# EAGLE design PCB-E21-TVS (EAGLE 7.5.0)

## Sheet 1 of 2
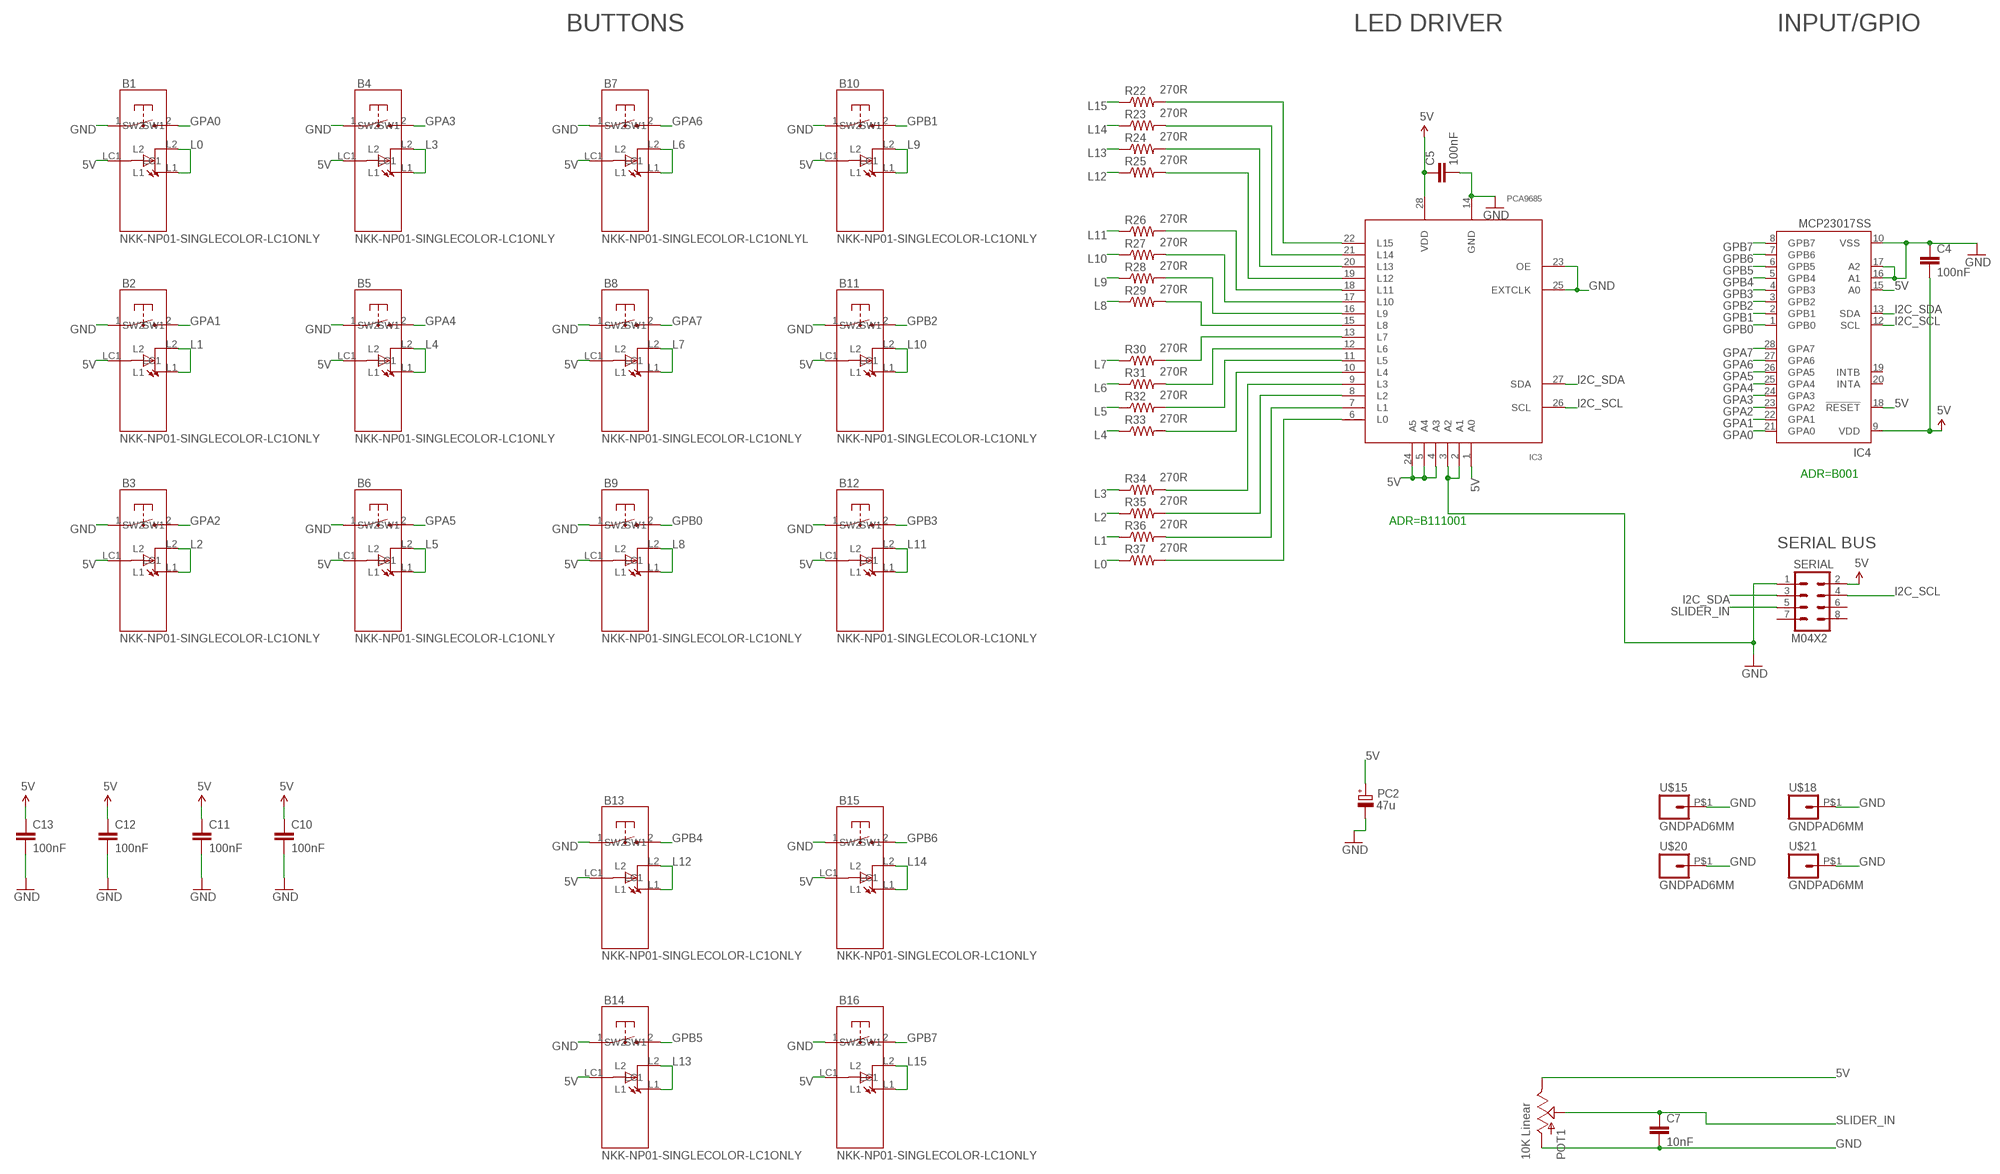
[diagram p0: schematic, sheet 1]

### Parts
B1  NKK-NP01-SINGLECOLOR-LC1ONLY  [NKK-NP01_LESSHOLES2]
B2  NKK-NP01-SINGLECOLOR-LC1ONLY  [NKK-NP01_LESSHOLES2]
B3  NKK-NP01-SINGLECOLOR-LC1ONLY  [NKK-NP01_LESSHOLES2]
B4  NKK-NP01-SINGLECOLOR-LC1ONLY  [NKK-NP01_LESSHOLES2]
B5  NKK-NP01-SINGLECOLOR-LC1ONLY  [NKK-NP01_LESSHOLES2]
B6  NKK-NP01-SINGLECOLOR-LC1ONLY  [NKK-NP01_LESSHOLES2]
B7  NKK-NP01-SINGLECOLOR-LC1ONLYL  [NKK-NP01_LESSHOLES3]
B8  NKK-NP01-SINGLECOLOR-LC1ONLY  [NKK-NP01_LESSHOLES2]
B9  NKK-NP01-SINGLECOLOR-LC1ONLY  [NKK-NP01_LESSHOLES2]
B10  NKK-NP01-SINGLECOLOR-LC1ONLY  [NKK-NP01_LESSHOLES2]
B11  NKK-NP01-SINGLECOLOR-LC1ONLY  [NKK-NP01_LESSHOLES2]
B12  NKK-NP01-SINGLECOLOR-LC1ONLY  [NKK-NP01_LESSHOLES2]
B13  NKK-NP01-SINGLECOLOR-LC1ONLY  [NKK-NP01_LESSHOLES2]
B14  NKK-NP01-SINGLECOLOR-LC1ONLY  [NKK-NP01_LESSHOLES2]
B15  NKK-NP01-SINGLECOLOR-LC1ONLY  [NKK-NP01_LESSHOLES2]
B16  NKK-NP01-SINGLECOLOR-LC1ONLY  [NKK-NP01_LESSHOLES2]
C4  100nF  CAP0603-CAP  [0603-CAP]
C5  100nF  CAP0603-CAP  [0603-CAP]
C7  10nF  CAP0603-CAP  [0603-CAP]
C10  100nF  CAP0603-CAP  [0603-CAP]
C11  100nF  CAP0603-CAP  [0603-CAP]
C12  100nF  CAP0603-CAP  [0603-CAP]
C13  100nF  CAP0603-CAP  [0603-CAP]
IC3  PCA9685  [TSSOP28]
IC4  MCP23017SS  [SSOP28]
PC2  47u  CPOL-EUD  [PANASONIC_D]
POT1  10K Linear  SLIDERC220  [SLIDER20-CAR2]
R22  270R  RESISTOR0603-RES  [0603-RES]
R23  270R  RESISTOR0603-RES  [0603-RES]
R24  270R  RESISTOR0603-RES  [0603-RES]
R25  270R  RESISTOR0603-RES  [0603-RES]
R26  270R  RESISTOR0603-RES  [0603-RES]
R27  270R  RESISTOR0603-RES  [0603-RES]
R28  270R  RESISTOR0603-RES  [0603-RES]
R29  270R  RESISTOR0603-RES  [0603-RES]
R30  270R  RESISTOR0603-RES  [0603-RES]
R31  270R  RESISTOR0603-RES  [0603-RES]
R32  270R  RESISTOR0603-RES  [0603-RES]
R33  270R  RESISTOR0603-RES  [0603-RES]
R34  270R  RESISTOR0603-RES  [0603-RES]
R35  270R  RESISTOR0603-RES  [0603-RES]
R36  270R  RESISTOR0603-RES  [0603-RES]
R37  270R  RESISTOR0603-RES  [0603-RES]
SERIAL  M04X2  [2X4]
U$15  GNDPAD6MM  [3.2MMPAD6MM]
U$18  GNDPAD6MM  [3.2MMPAD6MM]
U$20  GNDPAD6MM  [3.2MMPAD6MM]
U$21  GNDPAD6MM  [3.2MMPAD6MM]

### Nets
5V [Power]: B1.LC1 B2.LC1 B3.LC1 B4.LC1 B5.LC1 B6.LC1 B7.LC1 B8.LC1 B9.LC1 B10.LC1 B11.LC1 B12.LC1 B13.LC1 B14.LC1 B15.LC1 B16.LC1 C4.2 C5.1 C10.1 C11.1 C12.1 C13.1 IC3.1(A0) IC3.4(A3) IC3.5(A4) IC3.24(A5) IC3.28(VDD) IC4.9(VDD) IC4.15(A0) IC4.18(!RESET) PC2.+ POT1.1(E) SERIAL.2
GND [Power]: B1.1(SW1) B2.1(SW1) B3.1(SW1) B4.1(SW1) B5.1(SW1) B6.1(SW1) B7.1(SW1) B8.1(SW1) B9.1(SW1) B10.1(SW1) B11.1(SW1) B12.1(SW1) B13.1(SW1) B14.1(SW1) B15.1(SW1) B16.1(SW1) C4.1 C5.2 C7.2 C10.2 C11.2 C12.2 C13.2 IC3.2(A1) IC3.3(A2) IC3.14(GND) IC3.23(OE) IC3.25(EXTCLK) IC4.10(VSS) IC4.16(A1) IC4.17(A2) PC2.- POT1.3(A) SERIAL.1 U$15.P$1 U$18.P$1 U$20.P$1 U$21.P$1
GPA0: B1.2(SW2) IC4.21(GPA0)
GPA1: B2.2(SW2) IC4.22(GPA1)
GPA2: B3.2(SW2) IC4.23(GPA2)
GPA3: B4.2(SW2) IC4.24(GPA3)
GPA4: B5.2(SW2) IC4.25(GPA4)
GPA5: B6.2(SW2) IC4.26(GPA5)
GPA6: B7.2(SW2) IC4.27(GPA6)
GPA7: B8.2(SW2) IC4.28(GPA7)
GPB0 [Power]: B9.2(SW2) IC4.1(GPB0)
GPB1: B10.2(SW2) IC4.2(GPB1)
GPB2: B11.2(SW2) IC4.3(GPB2)
GPB3: B12.2(SW2) IC4.4(GPB3)
GPB4: B13.2(SW2) IC4.5(GPB4)
GPB5: B14.2(SW2) IC4.6(GPB5)
GPB6: B15.2(SW2) IC4.7(GPB6)
GPB7: B16.2(SW2) IC4.8(GPB7)
I2C_SCL: IC3.26(SCL) IC4.12(SCL) SERIAL.4
I2C_SDA: IC3.27(SDA) IC4.13(SDA) SERIAL.3
L0: B1.L1 B1.L2 R37.1
L1: B2.L1 B2.L2 R36.1
L2: B3.L1 B3.L2 R35.1
L3: B4.L1 B4.L2 R34.1
L4: B5.L1 B5.L2 R33.1
L5: B6.L1 B6.L2 R32.1
L6: B7.L1 B7.L2 R31.1
L7: B8.L1 B8.L2 R30.1
L8: B9.L1 B9.L2 R29.1
L9: B10.L1 B10.L2 R28.1
L10: B11.L1 B11.L2 R27.1
L11: B12.L1 B12.L2 R26.1
L12: B13.L1 B13.L2 R25.1
L13: B14.L1 B14.L2 R24.1
L14: B15.L1 B15.L2 R23.1
L15: B16.L1 B16.L2 R22.1
N$2: IC3.13(L7) R30.2
N$19: IC3.12(L6) R31.2
N$23: IC3.11(L5) R32.2
N$31: IC3.10(L4) R33.2
N$58: IC3.9(L3) R34.2
N$59: IC3.8(L2) R35.2
N$67: IC3.7(L1) R36.2
N$74: IC3.6(L0) R37.2
N$75: IC3.15(L8) R29.2
N$76: IC3.16(L9) R28.2
N$77: IC3.17(L10) R27.2
N$78: IC3.18(L11) R26.2
N$79: IC3.19(L12) R25.2
N$80: IC3.20(L13) R24.2
N$81: IC3.21(L14) R23.2
N$82: IC3.22(L15) R22.2
SLIDER_IN: C7.1 POT1.2A(S) SERIAL.5
Unconnected: IC4.19(INTB) IC4.20(INTA) SERIAL.6 SERIAL.7 SERIAL.8

### Notes on the sheet
- BUTTONS | LED DRIVER | INPUT/GPIO
- ADR=B001
- ADR=B111001
- SERIAL BUS

## Sheet 2 of 2

## Library data of the parts
B1-B16 = SKAARHOJ:NKK-NP01-SINGLECOLOR-LC1ONLY
C4 C5 C7 C10-C13 = SparkFun:CAP: Capacitor Standard 0603 ceramic capacitor, and 0.1" leaded capacitor.
IC3 = wsmith:PCA9685
IC4 = microchip:MCP23017: http://ww1.microchip.com/downloads/en/DeviceDoc/21952a.pdf Source: http://ww1.microchip.com/downloads/en/DeviceDoc/21952a.pdf; MF: MICROCHIP; MPN: MCP23017-E/SS; OC_FARNELL: 1467674; OC_NEWARK: 31K2960
PC2 = rcl:CPOL-EU: POLARIZED CAPACITOR, European symbol
POT1 = SKAARHOJ:SLIDER
R22-R37 = SparkFun:RESISTOR: Resistor Basic schematic elements and footprints for 0603, 1206, and PTH resistors.
SERIAL = SparkFun:M04X2
U$15 U$18 U$20 U$21 = SKAARHOJ:GNDPAD

## Net classes
0 default: width 0.203 mm, drill 0.305 mm, clearance 0.203 mm
1 Power: width 0.406 mm, drill 0.457 mm, clearance 0.203 mm
2 RELAY LINES: width 0.305 mm, drill 0.305 mm, clearance 0.203 mm
3 INput lines: width 0.203 mm, drill 0.305 mm, clearance 0.203 mm

## Board
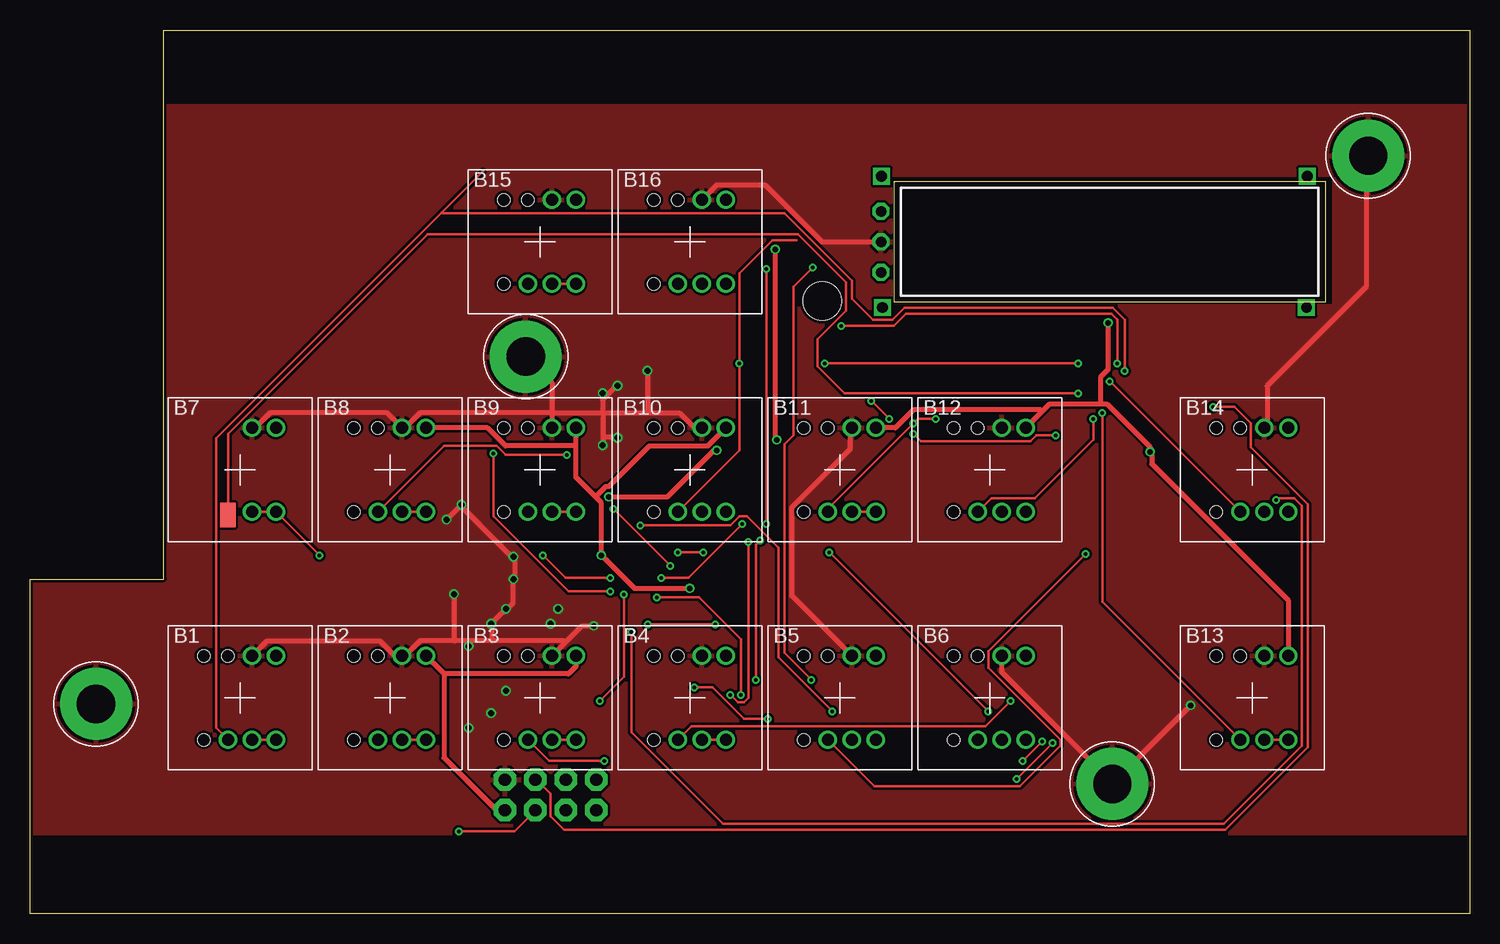
[diagram p1: board, top side]
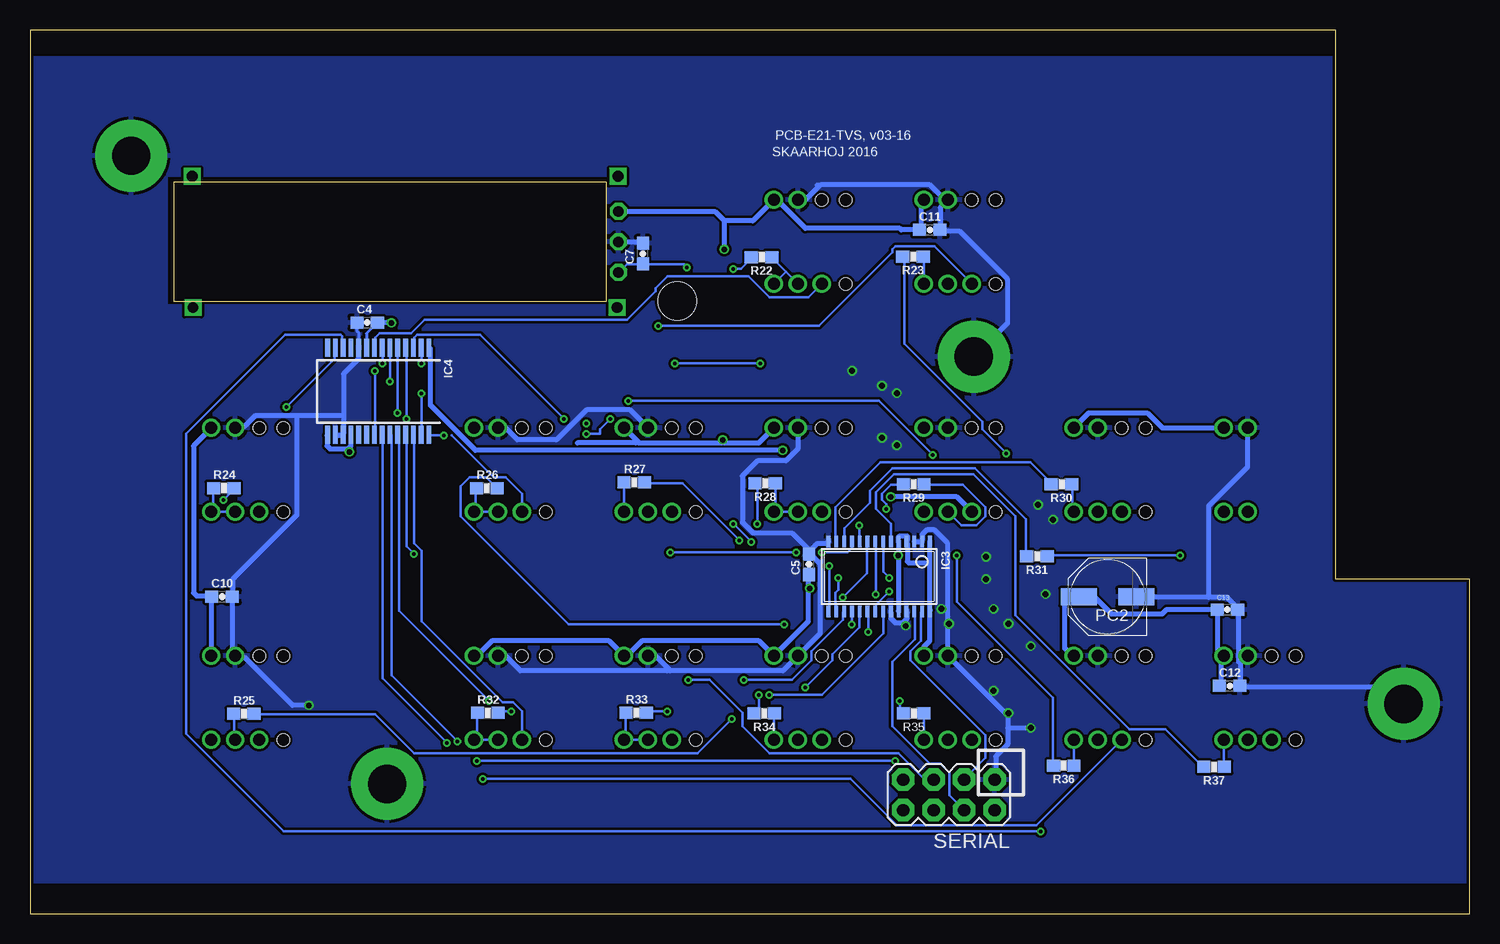
[diagram p2: board, bottom side, seen from below]

Size 120 x 73.66 mm. Coordinates in mm from the lower left corner, seen from the top.
Outline: 0,0 0,27.9 11.16,27.9 11.16,73.66 120,73.66 120,0 0,0
Copper layers (1*16): Top 0.035mm / dielectric 1.5mm / Bottom 0.035mm
Design rules "Fusion_eagle_rule_v1.1": minimum track width 6mil, minimum drill 12mil, track to track 6mil, track to pad 6mil, pad to pad 6mil, via to via 6mil, smd to smd 0mil, copper to edge 10mil, drill to drill 10mil, minimum pad ring 10mil, minimum via ring 6mil, stop-mask expansion 2mil, vias tented up to drill 100mil, thermal gap 10mil
Holes 3.2 mm at 66.04,51.07
tRestrict: area 0,0 to 120,6.5; area 0,67.5 to 120,74; area 71.9,50.8 to 108.5,61.4
bRestrict: area 0,71.5 to 120,74; area 0,0 to 120,2.5; area 71.9,50.8 to 108.5,61.4
Milling: area 72,51 to 108,61

### Footprints (pad centres in the part's own frame; a part is rotated, then mirrored left to right if it is on the bottom)
NKK-NP01_LESSHOLES2 = drill 1: 1 1,3.5; 2 -1,-3.5; L1 3,-3.5; L2 1,-3.5; LC1 3,3.5 | hole 1: -3,3.5; -3,-3.5; -1,3.5
NKK-NP01_LESSHOLES3 = drill 1: 1 1,3.5; L1 3,-3.5; L2 1,-3.5; LC1 3,3.5 | smd 1.27 x 2.032: 2 -1,-3.754
0603-CAP = smd 1.1 x 1: 1 -0.85,0; 2 0.85,0
TSSOP28 = smd 0.305 x 0.991: 1 -4.225,-2.918; 2 -3.575,-2.918; 3 -2.925,-2.918; 4 -2.275,-2.918; 5 -1.625,-2.918; 6 -0.975,-2.918; 7 -0.325,-2.918; 8 0.325,-2.918; 9 0.975,-2.918; 10 1.625,-2.918; 11 2.275,-2.918; 12 2.925,-2.918; 13 3.575,-2.918; 14 4.225,-2.918; 15 4.225,2.918; 16 3.575,2.918; 17 2.925,2.918; 18 2.275,2.918; 19 1.625,2.918; 20 0.975,2.918; 21 0.325,2.918; 22 -0.325,2.918; 23 -0.975,2.918; 24 -1.625,2.918; 25 -2.275,2.918; 26 -2.925,2.918; 27 -3.575,2.918; 28 -4.225,2.918
SSOP28 = smd 0.4 x 1.5: 1 -4.225,-3.625; 2 -3.575,-3.625; 3 -2.925,-3.625; 4 -2.275,-3.625; 5 -1.625,-3.625; 6 -0.975,-3.625; 7 -0.325,-3.625; 8 0.325,-3.625; 9 0.975,-3.625; 10 1.625,-3.625; 11 2.275,-3.625; 12 2.925,-3.625; 13 3.575,-3.625; 14 4.225,-3.625; 15 4.225,3.625; 16 3.575,3.625; 17 2.925,3.625; 18 2.275,3.625; 19 1.625,3.625; 20 0.975,3.625; 21 0.325,3.625; 22 -0.325,3.625; 23 -0.975,3.625; 24 -1.625,3.625; 25 -2.275,3.625; 26 -2.925,3.625; 27 -3.575,3.625; 28 -4.225,3.625
PANASONIC_D = smd 3 x 1.4: + 2.4,0; - -2.4,0
SLIDER20-CAR2 = drill 0.9 octagon: 1 -19.05,2.54; 2A -19.05,-2.54; 3 -19.05,0 | drill 0.9 square: P$1 -19.012,5.461; P$2 16.472,5.461; P$3 16.408,-5.461; P$4 -18.948,-5.461
0603-RES = smd 1.1 x 1: 1 -0.85,0; 2 0.85,0
2X4 = drill 1.016 pad 1.88 octagon: 1 -3.81,-1.27; 2 -3.81,1.27; 3 -1.27,-1.27; 4 -1.27,1.27; 5 1.27,-1.27; 6 1.27,1.27; 7 3.81,-1.27; 8 3.81,1.27
3.2MMPAD6MM = drill 3.2 pad 6: P$1 0,0

### Placement (x,y rotation side)
B1  17.5,18 0 top
B2  30,18 0 top
B3  42.5,18 0 top
B4  55,18 0 top
B5  67.5,18 0 top
B6  80,18 0 top
B7  17.5,37 0 top
B8  30,37 0 top
B9  42.5,37 0 top
B10  55,37 0 top
B11  67.5,37 0 top
B12  80,37 0 top
B13  101.88,18 0 top
B14  101.88,37 0 top
B15  42.5,56 0 top
B16  55,56 0 top
C4  91.89,49.28 0 bottom
C5  55.07,29.13 90 bottom
C7  68.91,55.03 90 bottom
C10  104,26.44 0 bottom
C11  45,57 0 bottom
C12  20,19 0 bottom
C13  20.18,25.36 0 bottom
IC3  49.21,28.12 180 bottom
IC4  90.97,43.54 180 bottom
PC2  30.18,26.42 180 bottom
POT1  90,56 0 top
R22  59.02,54.74 180 bottom
R23  46.39,54.77 180 bottom
R24  103.85,35.49 0 bottom
R25  102.18,16.67 0 bottom
R26  81.91,35.49 0 bottom
R27  69.62,35.97 0 bottom
R28  58.72,35.88 180 bottom
R29  46.33,35.81 180 bottom
R30  34.02,35.8 180 bottom
R31  36.06,29.8 180 bottom
R32  81.84,16.74 0 bottom
R33  69.47,16.76 0 bottom
R34  58.79,16.7 180 bottom
R35  46.34,16.7 180 bottom
R36  33.82,12.36 180 bottom
R37  21.29,12.24 180 bottom
SERIAL  43.4,9.92 180 bottom
U$15  90.23,10.84 0 top
U$18  111.56,63.18 0 top
U$20  5.5,17.5 0 top
U$21  41.32,46.44 0 top

### Tracks (layer width: path | path; a pad name or v marks a point on that pad's centre or on a via)
5V  (via drill 0.46)
  Top 0.406: 34.5,20 34.5,13 38.75,8.75 39.5,8.75 SERIAL.2 | B2.LC1 34.5,20 | 45.5,39 45.5,36.38 47.12,34.75 | 45.5,39 B9.LC1 | 47.12,34.75 47.62,34.25 v47.62,29.88 50.38,27.12 v55,27.12 | B8.LC1 38.12,40.5 39.62,39 45.5,39 | B10.LC1 56.5,39 51.62,39 48.25,35.62 48,35.62 47.12,34.75 | v62.12,55.38 62.12,39.62 v62.25,39.5 | 34.5,20 44.88,20 45.5,20.62 B3.LC1 | 89.25,42.5 85,42.5 84.38,41.88 | 89.25,42.5 89.75,42.5 93.38,38.88 v93.38,38.5 93.5,38.38 93.5,37.5 104.88,26.12 B13.LC1 | B12.LC1 84.38,41.88 | v89.88,49.25 89.88,45.38 89.25,44.75 89.25,42.5 | B11.LC1 72.12,40.5 73.62,42 84.25,42 84.38,41.88
  Bottom 0.254: C4.2 91.94,48.37 IC4.9
  Bottom 0.406: B13.LC1 104.88,26.38 C10.1 105,26.5 106.12,26.5 106.38,26.75 106.38,39 105,40.38 B14.LC1 104.62,40.5 | C12.1 20.75,19 20.75,21.25 B1.LC1 21,22 21,25.25 C13.1 21.12,25.38 25.25,25.38 25.62,25 29.88,25 31.25,26.38 32.5,26.38 PC2.+ 32.62,26.38 33.62,26.38 33.75,26.25 33.75,22.12 33.12,21.5 B2.LC1 | B15.LC1 45.75,59.25 45.75,57 C11.1 47.38,57 47.5,57.12 55.38,57.12 57.75,59.5 B16.LC1 59.75,57.75 62.12,57.75 | 55.12,27.12 55.12,24.38 B4.LC1 59.25,22.75 69,22.75 70.25,21.5 B5.LC1 71.75,22.75 81.5,22.75 82.75,21.5 B6.LC1 | 55.12,27.12 55.12,28.25 C5.1 | B10.LC1 59.25,39.25 62.25,39.25 | 62.25,39.25 69.25,39.25 69.38,39.38 | B11.LC1 69.38,39.38 | 74.38,39.25 69.5,39.25 69.38,39.38 | B7.LC1 25.62,40.5 26.88,41.75 31.75,41.75 B8.LC1 | B3.LC1 45.5,22.25 45,22.75 45,25.12 IC3.28 45,25.38 45,29.25 | 45,29.25 45,31 IC3.1 | IC3.24 47.62,25.25 v47.62,29.88 47.62,31 IC3.5 47.62,31.12 47.62,31.38 47.5,31.5 46.88,31.5 46.88,31.12 IC3.4 46.88,30.88 46.88,29.38 46.75,29.25 45,29.25 | v55,27.12 55.12,27.12 | v62.12,55.38 62.12,57.75 | v62.25,39.5 62.25,39.25 | 62.12,57.75 62.88,58.5 70.88,58.5 POT1.1 | 93.5,38.75 93.25,39 93.25,39.88 IC4.18 | 93.5,38.75 95,38.75 95.25,39 95.25,39.88 IC4.15 | v93.38,38.5 93.38,38.62 93.5,38.75 | v89.88,49.25 91,49.25 C4.2
GND  (via drill 0.46, 0.5)
  Top 0.406: 111.5,63.12 U$18.P$1 111.38,63 111.38,52.25 103.12,44 103.12,40.62 B14.1 103,40.5 | B6.1 81,20.12 90.25,10.88 U$15.P$1 90.38,11 v96.75,17.38 | 68.75,40.5 B11.1 68.38,40.38 68.38,38.75 63.5,33.88 63.5,26.5 B5.1 | B7.1 18.75,40.5 20,41.75 29.75,41.75 B8.1 31.12,40.62 31.38,40.62 32.5,41.75 43.5,41.75 | 43.5,41.75 43.5,44.25 41.38,46.38 U$21.P$1 | 43.5,41.75 B9.1 | B10.1 55.38,40.5 54.12,41.75 51.5,41.75 | 43.5,41.75 47.75,41.75 | 47.75,41.75 51.5,41.75 | v47,24 46,24 44.62,22.62 | B3.1 44.62,22.62 | 38.5,22.75 44.5,22.75 44.62,22.62 | 38.5,22.75 36.62,22.75 | 36.62,22.75 35.38,22.75 | 35.38,22.75 32.5,22.75 31.25,21.5 B2.1 30.88,21.62 30.25,21.62 29.12,22.75 19.75,22.75 B1.1 | v34.72,32.86 34.75,32.88 35.88,34 v35.96,34.1 36,33.88 40.12,29.75 v40.3,29.76 40.38,29.75 40.38,28 v40.3,27.9 40.25,27.75 40.25,25.88 39.88,25.5 v39.68,25.42 39.62,25.38 38.5,24.25 v38.44,24.18 38.5,24.12 38.5,22.75 | 35.38,22.75 35.38,26.62 v35.34,26.66 | 36.62,22.75 36.62,22.38 v36.58,22.32 | 47.75,41.75 47.75,39.75 | 47.75,39.75 47.75,39.12 v47.74,39.06 | 47.75,41.75 47.75,43.38 v47.74,43.4 47.88,43 48.88,44 v48.98,44.02 | 47.75,39.75 48.88,39.75 v48.98,39.68 | 51.5,41.75 51.5,45.25 v51.46,45.26 | POT1.3 66,56 61.25,60.75 57.25,60.75 B16.1
  Bottom 0.254: IC4.10 92.58,47.18 92.58,48.41 92.74,48.57 C4.1
  Bottom 0.406: B14.1 102.75,40.62 102.12,40.62 101.25,41.5 97.75,41.5 | IC3.14 53.5,31 53.62,30.88 54.38,30.88 55,30.25 55,30 C5.2 | C5.2 54.88,29.88 54.12,29.12 54.12,23.38 B4.1 57.25,20.25 66.62,20.25 66.75,20.38 | B5.1 67.88,21.5 66.75,20.38 | B6.1 80.38,21.5 79.12,20.25 66.88,20.25 66.75,20.38 | B16.1 55.38,59.5 54.25,60.62 | 54.25,60.62 54.12,60.75 45,60.75 43.75,59.5 B15.1 44.12,58.88 44.12,57 C11.2 44,56.88 42.5,56.88 38.5,52.88 38.5,49.25 41.25,46.5 U$21.P$1 | 47.25,24.25 46.88,24.62 46.88,25.12 IC3.25 | 47.25,24.25 47.88,24.25 48.25,24.62 48.25,25.12 IC3.23 | IC3.3 46.25,31 45.75,31 IC3.2 45.62,31.25 45.62,31.62 45.25,32 44.62,32 43.5,30.88 43.5,25.5 | 43.5,24.25 B3.1 40.12,18.12 | 43.5,24.25 43.5,25.5 | v47,24 47.25,24.25 | 38.5,15.5 38.5,16.5 38.62,16.62 | 38.5,15.5 38.5,14.12 39.5,13.12 39.5,11.25 SERIAL.1 | 40.12,18.12 38.62,16.62 | 19.12,20.88 19.12,19 C12.2 19,18.88 6.88,18.88 U$20.P$1 | B1.1 19.12,20.88 | 19.12,20.88 19.25,21 19.25,25.25 C13.2 19.38,25.5 20.25,26.38 21.75,26.38 | 21.75,26.38 27.75,26.38 PC2.- | B7.1 18.5,37.25 21.75,34 21.75,26.38 | B10.1 56,38.75 57,37.75 59.38,37.75 60.62,36.5 60.62,32.62 59.75,31.75 56.5,31.75 55.12,30.38 C5.2 | 54.38,60.75 54.25,60.62 | IC4.16 94.5,39.88 94,39.88 IC4.17 93.88,40.12 93.88,41.5 | 93.88,41.5 93.88,45 92.62,46.25 92.62,47.12 IC4.10 | 93.88,41.5 97.75,41.5 | 97.75,41.5 97.75,33.25 103.12,27.88 103.12,26.62 C10.2 103.12,26.38 103.12,21.62 103,21.5 B13.1 102.75,21.38 102.12,21.38 98.12,17.38 v96.75,17.38 | POT1.3 69,56 C7.2 | 38.5,15.5 v36.58,15.5 | v38.44,16.74 38.5,16.75 38.62,16.62 | 40.12,18.12 39.75,18.5 v39.68,18.6
  Bottom 0.406: v43.4,24.18 43.38,24.25 43.5,24.25 | 43.5,25.5 44,25.5 v44.02,25.42 | B12.1 80.38,40.5 79.38,39.5 76.12,39.5 73.62,42 70,42 B11.1
  pour Top: 0,0 120.28,0 120.28,73.78 0,73.78
  pour Bottom: 0,0 120.28,0 120.28,73.78 0,73.78
GPA0  (via drill 0.3)
  Top 0.203: 34.31,58.44 15.5,39.62 15.5,15.5 B1.2 | 34.31,58.44 37.75,61.88 | v91.25,45.25 91.25,49.5 90.25,50.5 72.88,50.5 71.88,49.5 70.25,49.5 68.5,51.25 68.5,52.75 62.88,58.38 34.38,58.38 34.31,58.44
  Bottom 0.203: v91.25,45.25 91.25,40 IC4.21
GPA1  (via drill 0.3)
  Top 0.203: v82.25,11.25 v85.25,14.25
  Bottom 0.203: v85.25,14.25 90.62,19.62 90.62,39.88 IC4.22 | v82.25,11.25 51.62,11.25 47.75,7.38 36.12,7.38 B2.2
GPA2  (via drill 0.3)
  Top 0.203: v82.75,12.75 v84.38,14.38 | v47.88,12.75 43.25,12.75 B3.2
  Bottom 0.203: v84.38,14.38 89.88,19.88 89.88,39.88 IC4.23 | v47.88,12.75 v82.75,12.75
GPA3  (via drill 0.3)
  Top 0.203: v81.75,17.75 79.62,15.62 55.12,15.62 B4.2
  Bottom 0.203: v81.75,17.75 89.25,25.25 89.25,39.88 IC4.24
GPA4  (via drill 0.3)
  Top 0.203: v88,30 79.88,21.88 79.88,20.5 85.88,14.5 85.88,14 82.5,10.62 70.38,10.62 B5.2
  Bottom 0.203: v88,30 88.62,30.62 88.62,39.88 IC4.25
GPA5
  Bottom 0.203: B6.2 79,16.88 79.75,17.62 80.62,17.62 87.38,24.38 87.38,30.25 88,30.88 88,39.88 IC4.26
GPA6  (via drill 0.3)
  Top 0.203: B7.2 16.5,40 33.12,56.62 64,56.62 68,52.62 68,50.25 65.62,47.88 65.62,45.62 67.88,43.38 v87.38,43.38
  Bottom 0.203: v87.38,43.38 87.38,40 IC4.27
GPA7  (via drill 0.3)
  Top 0.203: v73.62,40 74.25,39.38 83.38,39.38 83.88,39.88 v85.5,39.88 | v44.75,38.25 39.62,38.25 38.88,39 34.5,39 B8.2 | v70.12,42.75 v71.62,41.25
  Bottom 0.203: v73.62,40 72.5,40 72.5,40.38 v71.62,41.25 | v44.75,38.25 49.25,42.75 v70.12,42.75 | v85.5,39.88 86.62,39.88 IC4.28
GPB0  (via drill 0.46)
  Top 0.406: v57.25,38.62 57,38.62 53.12,34.75 v48.25,34.75
  Bottom 0.406: v57.25,38.62 82.88,38.62 86.62,42.38 86.62,47.12 IC4.1 | v48.25,34.75 42.75,34.75 B9.2
GPB1  (via drill 0.3)
  Top 0.203: 63.88,56.12 61.88,56.12 59.12,53.38 v59.12,45.88 59.12,38.62 B10.2 | v66.25,45.88 v87.38,45.88
  Bottom 0.203: v87.38,45.88 87.38,47.12 IC4.2 | v59.12,45.88 v66.25,45.88
GPB2  (via drill 0.3)
  Top 0.203: B11.2 66.5,33.75 v73.62,40.88 74,41.25 v75.5,41.25
  Bottom 0.203: v75.5,41.25 82.5,48.25 87.75,48.25 88,48 88,47.25 IC4.3
GPB3  (via drill 0.3)
  Top 0.203: v88.62,41.25 88.62,39.5 83.75,34.62 80.12,34.62 B12.2
  Bottom 0.203: 84.88,39.88 81.38,36.38 80.38,36.38 79,35 B12.2 | v88.62,41.25 88.62,47.12 IC4.4
GPB4  (via drill 0.3)
  Top 0.203: B13.2 89.38,26 v89.38,41.75
  Bottom 0.203: v89.38,41.75 89.38,47.12 IC4.5
GPB5  (via drill 0.3)
  Top 0.203: v90,44.38 B14.2
  Bottom 0.203: v90,44.38 90,47.12 IC4.6
GPB6  (via drill 0.3)
  Top 0.203: v90.62,45.88 90.62,49.5 90.12,50 73,50 72,49 v67.62,49
  Bottom 0.203: B15.2 44.62,55.62 47.88,55.62 48.12,55.38 48.12,55.12 54.25,49 v67.62,49 | v90.62,45.88 90.62,47.12 IC4.7
GPB7
  Bottom 0.203: B16.2 55.12,51.38 58.38,51.38 60.12,53.12 66.88,53.12 67.88,52.12 67.88,51.88 70.25,49.5 87.12,49.5 88.25,48.38 90.88,48.38 91.25,48 91.25,47.25 IC4.8
I2C_SCL  (via drill 0.3)
  Top 0.203: v35.75,6.88 40.38,6.88 42.12,8.62 SERIAL.4
  Bottom 0.203: IC3.26 46.25,25.12 46.25,22.88 48.12,21 48.12,15.62 45,12.5 44.12,12.5 43.38,11.75 43.38,9.88 42.25,8.75 SERIAL.4 | v35.75,6.88 98.88,6.88 107,15 107,40 98.75,48.25 94.12,48.25 94,48.12 94,47.25 IC4.12
I2C_SDA  (via drill 0.3)
  Top 0.203: SERIAL.3 42.25,11.12 43.38,10 43.38,8.12 44.5,7 99.62,7 106.5,13.88 106.5,34.12 101.75,38.88 101.75,40.88 100.38,42.25 v98.62,42.25
  Bottom 0.203: IC3.27 45.75,25.12 45.75,22.75 46.62,21.88 46.62,21.12 40.38,14.88 40.38,13 42.12,11.25 SERIAL.3 | v98.62,42.25 94.62,46.25 94.62,47.12 IC4.13
L0
  Top 0.203: B1.L1 B1.L2
  Bottom 0.203: B1.L1 20.5,12.25 R37.1
L1
  Top 0.203: B2.L1 B2.L2
  Bottom 0.203: B2.L1 33,12.38 R36.1
L2
  Top 0.203: B3.L1 B3.L2
  Bottom 0.203: B3.L1 45.5,16.62 R35.1
L3
  Top 0.203: B4.L1 B4.L2
  Bottom 0.203: B4.L1 58,16.62 R34.1
L4
  Bottom 0.203: R33.1 70.38,16.75 70.38,14.62 B5.L1 B5.L2
L5
  Bottom 0.203: R32.1 82.75,16.62 82.75,14.75 B6.L1 B6.L2
L6  (via drill 0.3)
  Top 0.203: v24.12,29.88 B7.L1 B7.L2
  Bottom 0.203: v24.12,29.88 35.12,29.88 R31.1
L7
  Top 0.203: B8.L1 B8.L2
  Bottom 0.203: B8.L1 33.12,33.62 33.12,35.75 R30.1
L8
  Top 0.203: B9.L2 B9.L1
  Bottom 0.203: B9.L2 42.38,32.38 41.12,32.38 40.38,33.12 40.38,33.88 42.25,35.75 45.38,35.75 R29.1
L9
  Bottom 0.203: R28.1 57.88,33.62 B10.L1 B10.L2
L10
  Top 0.203: B11.L1 B11.L2
  Bottom 0.203: B11.L1 70.5,35.88 R27.1
L11
  Bottom 0.203: R26.1 82.88,35.38 82.88,33.62 B12.L1 B12.L2
L12
  Top 0.203: B13.L2 B13.L1
  Bottom 0.203: R25.1 103,16.62 103,14.5 B13.L2
L13
  Bottom 0.203: R24.1 104.75,35.38 104.75,33.62 B14.L1 B14.L2
L14
  Top 0.203: B15.L1 B15.L2
  Bottom 0.203: B15.L1 45.5,54.75 R23.1
L15
  Bottom 0.203: B16.L2 57,53.5 | 57,53.5 58.12,54.62 R22.1 | 57,53.5 B16.L1
N$2
  Bottom 0.203: IC3.13 52.88,31.12 52.88,33.88 49.12,37.62 36.62,37.62 34.88,35.88 R30.2
N$19
  Bottom 0.203: IC3.12 52.12,31.12 52.12,32.12 50,34.25 50,35.25 48.12,37.12 41.25,37.12 37,32.88 37,29.88 R31.2
N$23  (via drill 0.3)
  Top 0.203: v56.12,30.12 v54,30.12 | v79.88,16.88 v66.62,30.12
  Bottom 0.203: v54,30.12 51.88,30.12 51.5,30.5 51.5,31 IC3.11 | v66.62,30.12 v56.12,30.12 | v79.88,16.88 80.75,16.88 80.88,16.75 R32.2
N$31  (via drill 0.3)
  Top 0.203: v50.88,32.38 58.38,32.38 59.12,33.12 59.75,33.12 62.38,30.5 62.38,21.38 v66.88,16.88
  Bottom 0.203: v50.88,32.38 50.88,31.12 IC3.10 | v66.88,16.88 68.5,16.88 R33.2
N$58  (via drill 0.3)
  Top 0.203: v52.25,26.38 55.75,26.38 59.25,22.88 v59.25,18.25
  Bottom 0.203: v52.25,26.38 50.25,28.38 50.25,31 IC3.9 | v59.25,18.25 59.25,17.12 59.62,16.75 R34.2
N$59  (via drill 0.3)
  Top 0.203: v49.5,26.62 49.5,19.75 v47.5,17.75
  Bottom 0.203: v49.5,26.62 49.5,31 IC3.8 | v47.5,17.75 47.5,17 47.25,16.75 R35.2
N$67  (via drill 0.3)
  Top 0.203: v48.38,28 44.62,28 v42.75,29.88
  Bottom 0.203: v48.38,28 48.88,28.5 48.88,31 IC3.7 | v42.75,29.88 42.75,26 34.75,18 34.75,12.38 R36.2
N$74
  Bottom 0.203: IC3.6 48.25,31.12 48.25,32.5 49.5,33.75 49.5,35.12 48,36.62 41.38,36.62 37.88,33.12 37.88,24.88 28.38,15.38 25.38,15.38 22.25,12.25 R37.2
N$75  (via drill 0.3)
  Top 0.203: v48.62,33.75 v53.38,29
  Bottom 0.203: v53.38,29 53.38,25.25 IC3.15 | v48.62,33.75 48.62,34.12 49,34.5 49,35 48.25,35.75 47.25,35.75 R29.2
N$76  (via drill 0.3)
  Top 0.203: v52.62,28 54.88,28 v59.38,32.5
  Bottom 0.203: v52.62,28 52.62,27 52.88,26.75 52.88,25.25 IC3.16 | v59.38,32.5 59.38,35.75 59.5,35.88 R28.2
N$77  (via drill 0.3)
  Top 0.203: v60.5,19.5 60.5,30.75 v60.88,31.12
  Bottom 0.203: v60.5,19.5 56.5,19.5 54.88,21.12 54.88,21.88 52.25,24.5 52.25,25.12 IC3.17 | v60.88,31.12 65.62,35.88 68.75,35.88 R27.2
N$78  (via drill 0.3)
  Top 0.203: v57.12,24.12 v51.5,24.12
  Bottom 0.203: v51.5,24.12 51.5,25.12 IC3.18 | v57.12,24.12 75.12,24.12 84.12,33.12 84.12,35.62 83.38,36.38 82,36.38 81.12,35.5 R26.2
N$79  (via drill 0.3)
  Top 0.203: v55.38,18.88 56.88,18.88 59.5,16.25 v61.5,16.25
  Bottom 0.203: v55.38,18.88 53.12,21.12 53.12,21.62 50.88,23.88 50.88,25.12 IC3.19 | v61.5,16.25 64.38,13.38 88,13.38 91.25,16.62 101.25,16.62 R25.2
N$80  (via drill 0.3)
  Top 0.203: v50.12,23.5 50.12,15.12 57.75,7.5 99.5,7.5 106,14 106,34 105.38,34.62 104,34.62 v103.88,34.5
  Bottom 0.203: v50.12,23.5 50.12,25.12 IC3.20 | v103.88,34.5 103,35.38 R24.2
N$81  (via drill 0.3)
  Top 0.203: v48.38,26.88 44.88,26.88 38.62,33.12 v38.62,38.38
  Bottom 0.203: v48.38,26.88 49.5,25.75 49.5,25.25 IC3.21 | v38.62,38.38 40.62,40.38 40.62,41 47.12,47.5 47.12,54.75 R23.2
N$82  (via drill 0.3)
  Top 0.203: v58.38,18.25 59,17.62 59.5,17.62 59.88,18 v59.88,31 | v61.38,53.75 v61.38,32.5
  Bottom 0.203: v58.38,18.25 54,18.25 48.88,23.38 48.88,25.12 IC3.22 | v61.38,32.5 v59.88,31 | v61.38,53.75 60.75,53.75 59.88,54.62 R22.2
SLIDER_IN  (via drill 0.3)
  Top 0.203: v65.12,19.5 62.88,21.75 62.88,39.12 63.62,39.88 63.62,52.25 v65.25,53.88
  Bottom 0.203: v65.12,19.5 63.38,19.5 60.62,16.75 60.62,15.62 58.38,13.38 47.62,13.38 45.5,11.25 44.75,11.25 SERIAL.5 | POT1.2A 70.88,53.5 70.25,54.12 69,54.12 C7.1 68.88,54.12 65.5,54.12 v65.25,53.88

### Text on the board
_bsilk: PCB-E21-TVS, v03-16 | SKAARHOJ 2016